# EasyEDA Pro project 电机驱动DRV8701_V2.0（无限流）.epro

# Schematic DRV8701_V2.0（无限流）
Board Name: DRV8701_V2.0（无限流）; Create Date: 2025-05-28; Page Name: P1; Project Name: 电机驱动; Schematic Name: DRV8701_V2.0（无限流）; Update Date: 2025-05-29; Company: 嘉立创EDA; Page Size: A4; Version: V1.0
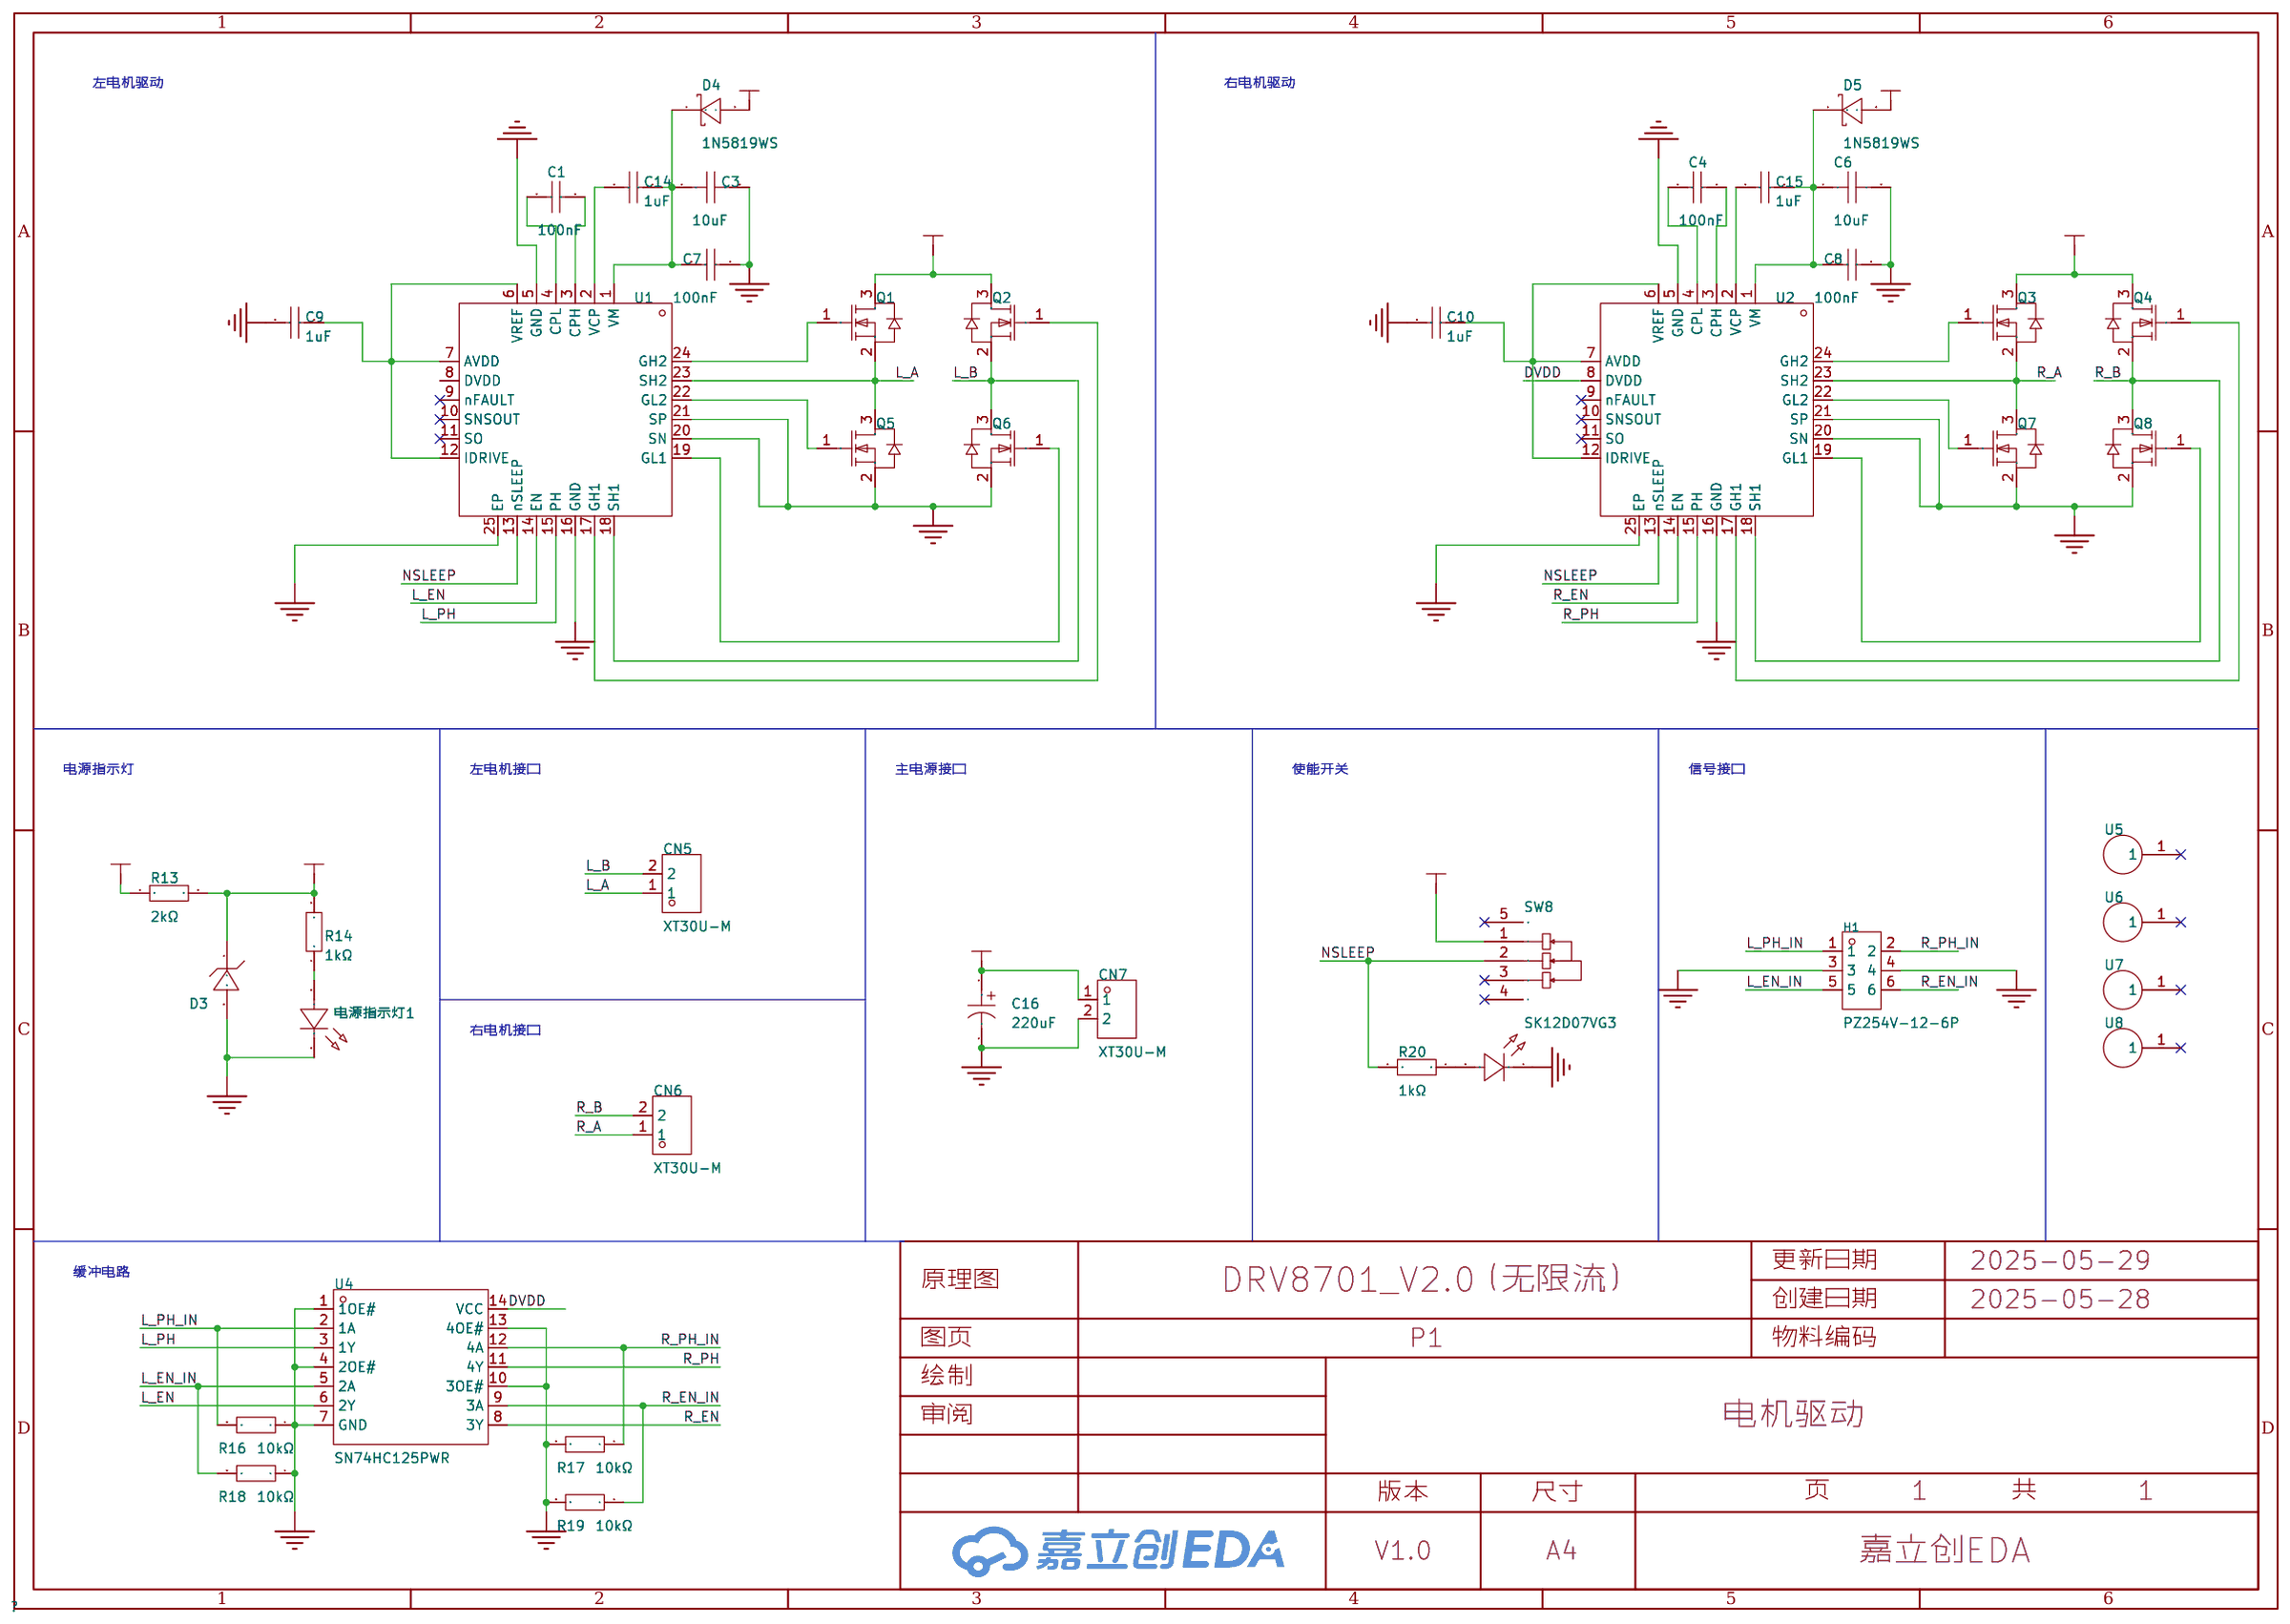
[diagram p0: schematic sheet]

## Parts
C1  100nF  [C0603]
C3  10uF  [C0603]
C4  100nF  [C0603]
C6  10uF  [C0603]
C7  100nF  [C0603]
C8  100nF  [C0603]
C9  1uF  [C0603]
C10  1uF  [C0603]
C14  1uF  [C0603]
C15  1uF  [C0603]
C16  220uF  [CAP-TH_BD6.3-P2.50-D0.5-FD]
CN5  XT30U-M  [CONN-TH_XT30U-M]
CN6  XT30U-M  [CONN-TH_XT30U-M]
CN7  XT30U-M  [CONN-TH_XT30U-M]
D3  BZT52C3V3-7-F  [SOD-123_L2.7-W1.6-LS3.7-RD]
D4  1N5819WS  [SOD-323_L1.8-W1.3-LS2.5-RD]
D5  1N5819WS  [SOD-323_L1.8-W1.3-LS2.5-RD]
H1  PZ254V-12-6P  [HDR-TH_6P-P2.54-V-M-R2-C3-S2.54]
Q1  2N7002  [DSOP-8_L5.0-W5.0-P1.27-LS6.0-BL-EP（rebuild）]
Q2  2N7002  [DSOP-8_L5.0-W5.0-P1.27-LS6.0-BL-EP（rebuild）]
Q3  2N7002  [DSOP-8_L5.0-W5.0-P1.27-LS6.0-BL-EP（rebuild）]
Q4  2N7002  [DSOP-8_L5.0-W5.0-P1.27-LS6.0-BL-EP（rebuild）]
Q5  2N7002  [DSOP-8_L5.0-W5.0-P1.27-LS6.0-BL-EP（rebuild）]
Q6  2N7002  [DSOP-8_L5.0-W5.0-P1.27-LS6.0-BL-EP（rebuild）]
Q7  2N7002  [DSOP-8_L5.0-W5.0-P1.27-LS6.0-BL-EP（rebuild）]
Q8  2N7002  [DSOP-8_L5.0-W5.0-P1.27-LS6.0-BL-EP（rebuild）]
R13  2kΩ  [R0603]
R14  1kΩ  [R0603]
R16  10kΩ  [R0603]
R17  10kΩ  [R0603]
R18  10kΩ  [R0603]
R19  10kΩ  [R0603]
R20  1kΩ  [R0603]
SW8  SK12D07VG3  [SW-TH_SK12D07VG3]
U1  DRV8701ERGET  [VQFN-24_L4.0-W4.0-P0.50-BL-EP2.5]
U2  DRV8701ERGET  [VQFN-24_L4.0-W4.0-P0.50-BL-EP2.5]
U4  SN74HC125PWR  [TSSOP-14_L5.0-W4.4-P0.65-LS6.5-BL]
U5  -  [M3螺丝孔]  (no BOM)
U6  -  [M3螺丝孔]  (no BOM)
U7  -  [M3螺丝孔]  (no BOM)
U8  -  [M3螺丝孔]  (no BOM)
电源指示灯1  XL-1608SURC-06  [LED0603-RD_RED]
电源指示灯2  XL-1608SURC-06  [LED0603-RD_RED]

## Library data of the parts
C1 C4 C7 C8 = CL10B104KO8NNNC: 容值:100nF;精度:±10%;额定电压:16V;材质(温度系数):X7R;; LCSC Part Name: 100nF ±10% 16V; Supplier Part: C66501; Manufacturer: SAMSUNG(三星); Supplier Footprint: 0603; JLCPCB Part Class: 扩展库; Datasheet: https://atta.szlcsc.com/upload/public/pdf/source/20160218/1457707763339.pdf; Supplier: LCSC; Tolerance: ±10%; Voltage Rated: 16V; Temperature Coefficient: X7R
C3 C6 = CL10A106MA8NRNC: 容值:10uF;精度:±20%;额定电压:25V;材质(温度系数):X5R;; LCSC Part Name: 10uF ±20% 25V; Supplier Part: C96446; Manufacturer: SAMSUNG(三星); Supplier Footprint: 0603; Datasheet: https://atta.szlcsc.com/upload/public/pdf/source/20160218/1457707763339.pdf; Supplier: LCSC; Tolerance: ±20%; Voltage Rated: 25V; Temperature Coefficient: X5R
C9 C10 C14 C15 = CL10B105KA8NNNC: 容值:1uF;精度:±10%;额定电压:25V;材质(温度系数):X7R;; LCSC Part Name: 1uF ±10% 25V; Supplier Part: C29936; Manufacturer: SAMSUNG(三星); Supplier Footprint: 0603; Datasheet: https://atta.szlcsc.com/upload/public/pdf/source/20160218/1457707763339.pdf; Supplier: LCSC; Tolerance: ±10%; Voltage Rated: 25V; Temperature Coefficient: X7R
C16 = 03EC0593: 容值:220uF;精度:±20%;额定电压:25V;纹波电流:400mA@100kHz;等效串联电阻:180mΩ@100kHz;; LCSC Part Name: 220uF ±20% 25V; Supplier Part: C2831777; Manufacturer: KNSCHA(科尼盛); Supplier Footprint: 插件,D6.3xL11.5mm; JLCPCB Part Class: 扩展库; Datasheet: https://atta.szlcsc.com/upload/public/pdf/source/20210511/C2831777_389FCE55455AE5EB982141C0CC76B0F0.pdf; Supplier: LCSC; Tolerance: ±20%; Rated Voltage: 25V; Ripple Current: 400mA@100kHz; Equivalent Series Resistance(ESR): 180mΩ@100kHz; Lead Spacing: 2.5mm; φD: 6.3mm; L: 11.5mm; Lifetime @ Temp: 7000hrs@105℃; Operating Temperature: -55℃~+105℃
CN5-CN7 = XT30U-M: 类别:-;类型1:-;; LCSC Part Name: AMASS(艾迈斯)轻量版锂电池插头公头 XT30U-M; Supplier Part: C99101; Manufacturer: AMASS(艾迈斯); JLCPCB Part Class: 扩展库; Datasheet: https://atta.szlcsc.com/upload/public/pdf/source/20170606/1496716542582.pdf; Supplier: LCSC; Brand: 艾迈斯; Type: 插头; Colour: 黄色; InterfaceType: 公头
D3 = BZT52C3V3-7-F: 二极管配置:独立式;稳压值(标称值):3.3V;稳压值(范围):3.1V~3.5V;功率:500mW;精度:±6%;; Supplier Part: C151564; Manufacturer: DIODES(美台); Supplier Footprint: SOD-123; Datasheet: https://atta.szlcsc.com/upload/public/pdf/source/20190711/C397931_3C6B91801DE45802E2D186F3C264AC27.pdf; Supplier: LCSC; Diode Configuration: 独立式; Zener Voltage (Nom): 3.3V; Reverse Leakage Current (Ir): 5uA@1V; Zener Voltage (Range): 3.1V~3.5V; Power Dissipation: 500mW; Zener Impedance (Zzt): 95Ω; Tolerance: ±6%
D4 D5 = 1N5819WS_C191023: 正向压降(Vf):600mV@1A;直流反向耐压(Vr):40V;整流电流:1A;; LCSC Part Name: 电压:40V 电流:1A; Supplier Part: C191023; Manufacturer: Hottech(合科泰); Supplier Footprint: SOD-323; JLCPCB Part Class: 基础库; Datasheet: https://atta.szlcsc.com/upload/public/pdf/source/20220428/3CB86FD8D28D653594B4E35F9D5AEFD9.pdf; Supplier: LCSC; Forward Voltage (Vf@If): 600mV@1A; Reverse Voltage (Vr): 40V; Rectified Current: 1A
H1 = PZ254V-12-6P: 排数:双排;总PIN位数:6P;间距:2.54mm;插针结构:2x3P;行距:2.54mm;安装类型:直插;圆针/方针:方针;额定电流:-;额定电压:-;配合针长度:6mm;塑高:2.5mm;端接针长度:3mm;触头材质:黄铜;触头镀层:-;工作温度范围:-40℃~+105℃;颜色:黑色;; LCSC Part Name: 2.54mm 2x3P 直插 方针; Supplier Part: C492420; Manufacturer: XFCN(兴飞); Supplier Footprint: 插件,P=2.54mm; JLCPCB Part Class: Extended Part; Datasheet: https://atta.szlcsc.com/upload/public/pdf/source/20200309/C492420_BAECB307B001054C09D200388220EAE6.pdf; Supplier: LCSC; Number of Rows: 双排; Number of Pins: 6P; Pitch: 2.54mm; Pin Structure: 2x3P; Row Spacing: 2.54mm; Mounting Type: 直插; Circluar Pins/Square Pins: 方针; Length of Mating Pin: 6mm; Insulation Height: 2.5mm; Length of End Connection Pin: 3mm; Contact Material: 黄铜; Operating Temperature Range: -40℃~+105℃; Color: 黑色
Q1-Q8 = TPH1R403NL(rebuild): LCSC Part Name: 1个N沟道 耐压:60V 电流:115mA; Supplier Part: C8545; Manufacturer: CJ(江苏长电/长晶); Supplier Footprint: SOT-23; Datasheet: https://atta.szlcsc.com/upload/public/pdf/source/20171228/C164913_15144413269051213916.pdf; Supplier: LCSC; Type: 1个N沟道; Drain Source Voltage (Vdss): 60V; Continuous Drain Current (Id): 115mA; Drain Source On Resistance (RDS(on)@Vgs,Id): 5Ω@10V; Power Dissipation (Pd): 225mW; Gate Threshold Voltage (Vgs(th)@Id): 2.5V@250uA; Input Capacitance (Ciss@Vds): 50pF; Reverse Transfer Capacitance (Crss@Vds): 5pF; Operating Temperature: -55℃~+150℃
R13 = 0603WAF2201T5E: 电阻类型:厚膜电阻;阻值:2.2kΩ;精度:±1%;功率:100mW;最大工作电压:75V;温度系数:±100ppm/℃;; LCSC Part Name: 2.2kΩ ±1% 100mW 厚膜电阻; Supplier Part: C4190; Manufacturer: UNI-ROYAL(厚声); Supplier Footprint: 0603; JLCPCB Part Class: 基础库; Datasheet: https://atta.szlcsc.com/upload/public/pdf/source/20200306/C422600_1E6D84923E4A46A82E41ADD87F860B5C.pdf; Supplier: LCSC; Type: 厚膜电阻; Tolerance: ±1%; Power(Watts): 100mW; Overload Voltage (Max): 75V; Temperature Coefficient: ±100ppm/℃; Operating Temperature Range: -55℃~+155℃
R14 R20 = 0603WAF1001T5E: 电阻类型:厚膜电阻;阻值:1kΩ;精度:±1%;功率:100mW;最大工作电压:75V;温度系数:±100ppm/℃;; LCSC Part Name: 1kΩ ±1% 100mW 厚膜电阻; Supplier Part: C21190; Manufacturer: UNI-ROYAL(厚声); Supplier Footprint: 0603; JLCPCB Part Class: 基础库; Datasheet: https://atta.szlcsc.com/upload/public/pdf/source/20200306/C422600_1E6D84923E4A46A82E41ADD87F860B5C.pdf; Supplier: LCSC; Type: 厚膜电阻; Tolerance: ±1%; Power(Watts): 100mW; Overload Voltage (Max): 75V; Temperature Coefficient: ±100ppm/℃; Operating Temperature Range: -55℃~+155℃
R16-R19 = 0603WAF1002T5E: 电阻类型:厚膜电阻;阻值:10kΩ;精度:±1%;功率:100mW;最大工作电压:75V;温度系数:±100ppm/℃;; LCSC Part Name: 厚膜电阻 10kΩ ±1% 100mW; Supplier Part: C25804; Manufacturer: UNI-ROYAL(厚声); Supplier Footprint: 0603; JLCPCB Part Class: 基础库; Datasheet: https://atta.szlcsc.com/upload/public/pdf/source/20200306/C422600_1E6D84923E4A46A82E41ADD87F860B5C.pdf; Supplier: LCSC; Type: 厚膜电阻; Tolerance: ±1%; Power(Watts): 100mW; Overload Voltage (Max): 75V; Temperature Coefficient: ±100ppm/℃; Operating Temperature Range: -55℃~+155℃
SW8 = SK12D07VG3: 电路结构:单刀双掷;安装方式:侧插;开关颜色:-;额定电流(DC):500mA;额定电压(DC):50V;额定电流(AC):-;额定电压(AC):-;机械寿命:5千次;; LCSC Part Name: 两档位卧式拨动开关,柄长3MM; Supplier Part: C431547; Manufacturer: SHOU HAN(首韩); Supplier Footprint: 插件; JLCPCB Part Class: 扩展库; Datasheet: https://atta.szlcsc.com/upload/public/pdf/source/20190925/C431547_01B93C6F3FA5C09E15F8CCBF4E6DB91A.pdf; Supplier: LCSC; Circuit: 单刀双掷; Pin Style: PC引脚; Switch Length: 8.7mm; Switch Width: 4.4mm; Switch Height: 4.7mm; Mounting Style: 侧插; Current Rating (DC): 500mA; Voltage Rating (DC): 50V; Mechanical Life: 5千次; Operating Temperature: -10℃~+50℃
U1 U2 = DRV8701ERGET: DRV8701 47V H 桥智能栅极驱动器; LCSC Part Name: 有刷直流电机驱动芯片 5.5V; Supplier Part: C132049; Manufacturer: TI(德州仪器); Supplier Footprint: VQFN-24(4x4); Datasheet: https://www.ti.com/cn/lit/gpn/drv8701; Supplier: LCSC
U4 = SN74HC125PWR: 输入类型:-;电源电压:2V~6V;元件数:4;每个元件位数:1;灌电流(IOL):7.8mA;拉电流(IOH):7.8mA;; Supplier Part: C132994; Manufacturer: TI(德州仪器); Supplier Footprint: TSSOP-14; JLCPCB Part Class: 扩展库; Datasheet: https://www.ti.com/cn/lit/gpn/sn74hc125; Supplier: LCSC; output type: 三态; Supply Voltage: 2V~6V; Number of Elements: 4; Number of Bits per Element: 1; Sink Current: 7.8mA; Source Current: 7.8mA; Logic Family: 74HC; Operating Temperature: -40℃~+85℃
U5-U8 = M3螺丝孔
电源指示灯1 电源指示灯2 = XL-1608SURC-06: 发光颜色:红色;功率:55mW;正向电流:25mA;主波长:617nm~621nm;透镜颜色:无色透明透镜;色温:-;发光角度:120°;载带方式:正贴;工作温度:-30℃~+85℃;; Supplier Part: C965799; Manufacturer: XINGLIGHT(成兴光); Supplier Footprint: 0603; Datasheet: https://atta.szlcsc.com/upload/public/pdf/source/20221102/D860AFDD1CDB02C5A8064103A32707E2.pdf; Supplier: LCSC; Emitted Color: 红色; Power Dissipation: 55mW; Forward Current: 25mA; Dominant Wavelength: 617nm~621nm; Peak Wavelength: 623nm; Lens Color: 无色透明透镜; Viewing Angle: 120°; Mounting Sytle: 正贴; Operating Temperature: -30℃~+85℃

## Nets
3.3V: D3.1(K) R13.2 R14.2 SW8.1
DVDD: U2.8(DVDD) U4.14(VCC)
GND: C3.2 C6.2 C7.1 C8.1 C9.2 C10.2 C16.2 CN7.2 D3.2(A) H1.3 H1.4 Q5.2(S) Q6.2(S) Q7.2(S) Q8.2(S) R16.1 R17.2 R18.1 R19.2 U1.5(GND) U1.16(GND) U1.20(SN) U1.21(SP) U1.25(EP) U2.5(GND) U2.16(GND) U2.20(SN) U2.21(SP) U2.25(EP) U4.1(1OE#) U4.4(2OE#) U4.7(GND) U4.10(3OE#) U4.13(4OE#) 电源指示灯1.1(K) 电源指示灯2.1(K)
L_A: CN5.1 Q1.2(S) Q5.3(D) U1.23(SH2)
L_B: CN5.2 Q2.2(S) Q6.3(D) U1.18(SH1)
L_EN: U1.14(EN) U4.6(2Y)
L_EN_IN: H1.5 R18.2 U4.5(2A)
L_PH: U1.15(PH) U4.3(1Y)
L_PH_IN: H1.1 R16.2 U4.2(1A)
NSLEEP: R20.2 SW8.2 U1.13(nSLEEP) U2.13(nSLEEP)
R_A: CN6.1 Q3.2(S) Q7.3(D) U2.23(SH2)
R_B: CN6.2 Q4.2(S) Q8.3(D) U2.18(SH1)
R_EN: U2.14(EN) U4.8(3Y)
R_EN_IN: H1.6 R19.1 U4.9(3A)
R_PH: U2.15(PH) U4.11(4Y)
R_PH_IN: H1.2 R17.1 U4.12(4A)
VM: C16.1 CN7.1 D4.2(A) D5.2(A) Q1.3(D) Q2.3(D) Q3.3(D) Q4.3(D) R13.1
$1N2924: C14.2 U1.2(VCP)
$1N2925: C1.1 U1.3(CPH)
$1N2926: C1.2 U1.4(CPL)
$1N2930: Q1.1(G) U1.24(GH2)
$1N2931: Q5.1(G) U1.22(GL2)
$1N2933: Q6.1(G) U1.19(GL1)
$1N2936: Q2.1(G) U1.17(GH1)
$1N2950: C9.1 U1.6(VREF) U1.7(AVDD) U1.12(IDRIVE)
$1N2981: C3.1 C7.2 C14.1 D4.1(K) U1.1(VM)
$1N2986: C15.2 U2.2(VCP)
$1N2987: C4.1 U2.3(CPH)
$1N2988: C4.2 U2.4(CPL)
$1N2992: Q3.1(G) U2.24(GH2)
$1N2993: Q7.1(G) U2.22(GL2)
$1N2995: Q8.1(G) U2.19(GL1)
$1N2998: Q4.1(G) U2.17(GH1)
$1N3012: C10.1 U2.6(VREF) U2.7(AVDD) U2.12(IDRIVE)
$1N3023: C6.1 C8.2 C15.1 D5.1(K) U2.1(VM)
$1N3029: R14.1 电源指示灯1.2(A)
$1N3716: R20.1 电源指示灯2.2(A)

Not connected (* = marked no-connect by the designer): SW8 3* 4* 5*; U1 8(DVDD) 9(nFAULT)* 10(SNSOUT)* 11(SO)*; U2 9(nFAULT)* 10(SNSOUT)* 11(SO)*; U5 1*; U6 1*; U7 1*; U8 1*

## Notes on the sheet
- 左电机驱动
- 右电机驱动
- 电源指示灯
- 左电机接口
- 主电源接口
- 使能开关
- 信号接口
- 右电机接口
- 缓冲电路

# Board DRV8701_V2.0（无限流）
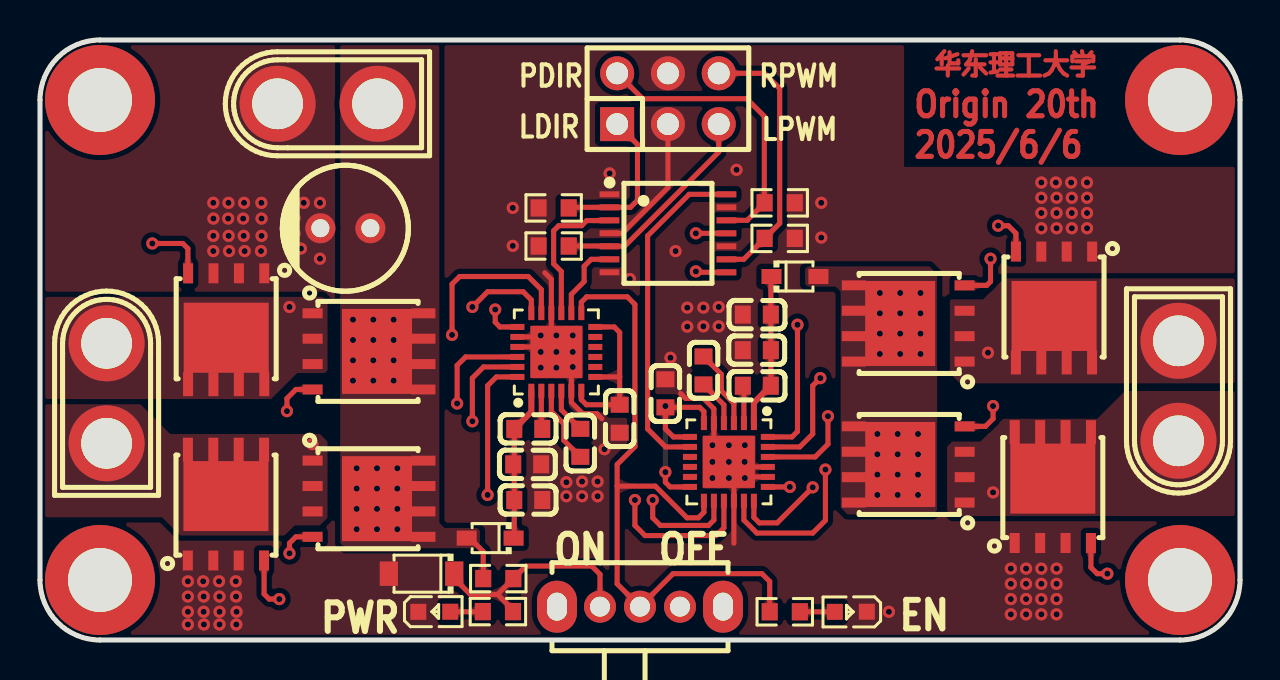
[diagram p1: board, top side]
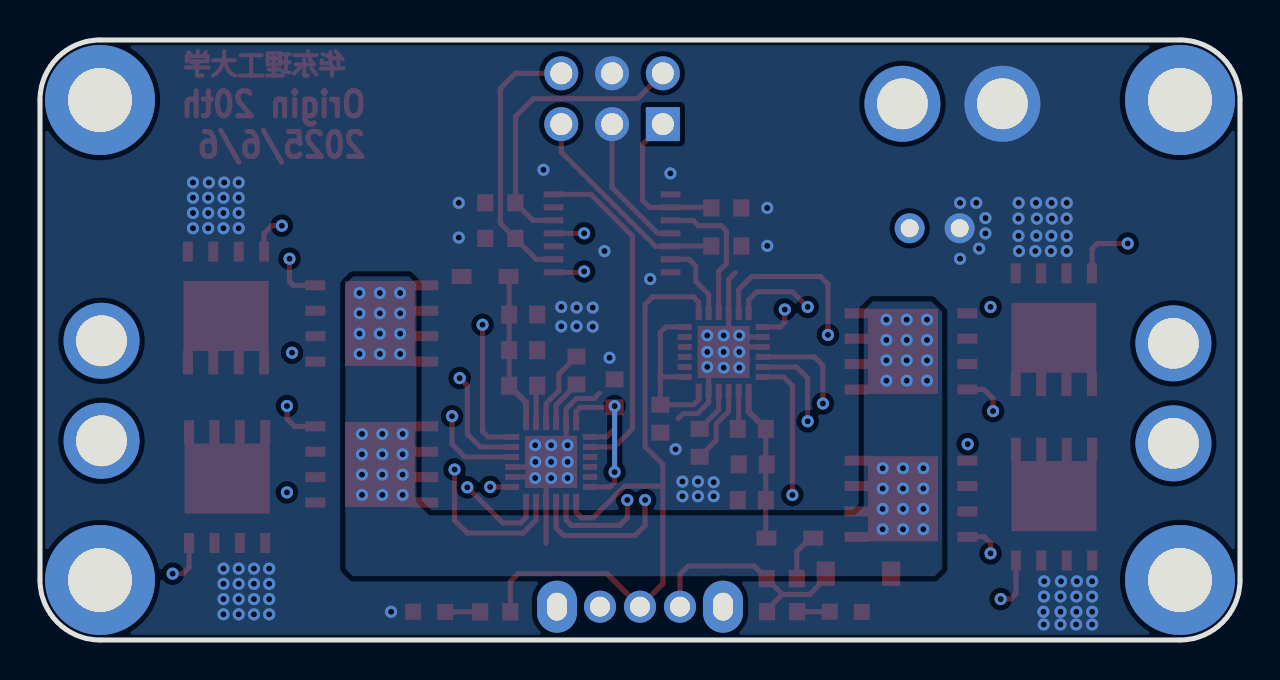
[diagram p2: board, bottom side, seen from below]

Outline 60 x 30 mm; copper layers: Top Layer, Inner1, Inner2, Bottom Layer. Coordinates in mm from the lower left corner of the outline.
Outline path: 0,27 0,3 arc(0.88,0.88) 3,0 57,0 arc(59.12,0.88) 60,3 60,27 arc(59.12,29.12) 57,30 3,30 arc(0.88,29.12) 0,27
Stack: Top Layer 0.035mm 外层铜厚1oz / Dielectric1 0.2104mm 7628 RC49% 8.6mil / Inner1 0.0152mm 内层铜厚 / Dielectric2 1.065mm 1.1mm H/HOZ Copper / Inner2 0.0152mm 内层铜厚 / Dielectric3 0.2104mm 7628 RC49% 8.6mil / Bottom Layer 0.035mm 外层铜厚1oz

## Design rules (mm)
template: 4层
spacing copperThickness1oz (default): track to track 0.102, other pairs 0.152 to 0.3
spacing copperThickness2oz: track to track 0.203, other pairs 0.152 to 0.3
spacing copperThicknessInner0.5oz: track to track 0.089, other pairs 0.152 to 0.3
spacing 板框焊盘0间距: track to track 0.152, other pairs 0 to 0.3
track width copperThickness1oz (default): min 0.102, default 0.254, max 2.54
track width copperThickness2oz: min 0.203, default 0.254, max 2.54
track width copperThickness0.5oz: min 0.089, default 0.254, max 2.54
differential pair differentialPair (default): width min 0.127, default 0.254, max 2.54; gap min 0.152, default 0.152
via viaSize (default): diameter min 0.3, default 0.61, max 10; hole min 0.2, default 0.305, max 6.3
region e13 uses 板框焊盘0间距
region e14 uses 板框焊盘0间距
region e15 uses 板框焊盘0间距
region e59 uses 板框焊盘0间距

## Placement (name value [footprint] x y rotation side)
C1  100nF  [C0603]  27.02 9.86 90 top
C3  10uF  [C0603]  24.41 7 0 top
C4  100nF  [C0603]  33.18 13.48 270 top
C6  10uF  [C0603]  35.84 16.27 180 top
C7  100nF  [C0603]  24.36 8.78 180 top
C8  100nF  [C0603]  35.84 14.49 0 top
C9  1uF  [C0603]  28.98 11.06 270 top
C10  1uF  [C0603]  31.27 12.33 90 top
C14  1uF  [C0603]  24.41 10.56 0 top
C15  1uF  [C0603]  35.84 12.71 180 top
C16  220uF  [CAP-TH_BD6.3-P2.50-D0.5-FD]  15.27 20.59 180 top
CN5  XT30U-M  [CONN-TH_XT30U-M]  3.33 12.33 90 top
CN6  XT30U-M  [CONN-TH_XT30U-M]  56.92 12.46 270 top
CN7  XT30U-M  [CONN-TH_XT30U-M]  14.38 26.81 180 top
D3  BZT52C3V3-7-F  [SOD-123_L2.7-W1.6-LS3.7-RD]  19.08 3.32 180 top
D4  1N5819WS  [SOD-323_L1.8-W1.3-LS2.5-RD]  22.51 5.09 180 top
D5  1N5819WS  [SOD-323_L1.8-W1.3-LS2.5-RD]  37.75 18.17 0 top
H1  PZ254V-12-6P  [HDR-TH_6P-P2.54-V-M-R2-C3-S2.54]  31.4 27.06 0 top
Q1  2N7002  [DSOP-8_L5.0-W5.0-P1.27-LS6.0-BL-EP（rebuild）]  16.4 7.06 270 top
Q2  2N7002  [DSOP-8_L5.0-W5.0-P1.27-LS6.0-BL-EP（rebuild）]  16.4 14.43 270 top
Q3  2N7002  [DSOP-8_L5.0-W5.0-P1.27-LS6.0-BL-EP（rebuild）]  43.46 15.83 90 top
Q4  2N7002  [DSOP-8_L5.0-W5.0-P1.27-LS6.0-BL-EP（rebuild）]  43.46 8.78 90 top
Q5  2N7002  [DSOP-8_L5.0-W5.0-P1.27-LS6.0-BL-EP（rebuild）]  9.3 6.75 0 top
Q6  2N7002  [DSOP-8_L5.0-W5.0-P1.27-LS6.0-BL-EP（rebuild）]  9.31 15.56 180 top
Q7  2N7002  [DSOP-8_L5.0-W5.0-P1.27-LS6.0-BL-EP（rebuild）]  50.7 16.65 180 top
Q8  2N7002  [DSOP-8_L5.0-W5.0-P1.27-LS6.0-BL-EP（rebuild）]  50.64 7.62 0 top
R13  2kΩ  [R0603]  22.91 3.07 0 top
R14  1kΩ  [R0603]  22.9 1.42 0 top
R16  10kΩ  [R0603]  25.68 21.6 0 top
R17  10kΩ  [R0603]  36.99 21.86 0 top
R18  10kΩ  [R0603]  25.68 19.7 0 top
R19  10kΩ  [R0603]  36.99 20.08 0 top
R20  1kΩ  [R0603]  37.24 1.41 180 top
SW8  SK12D07VG3  [SW-TH_SK12D07VG3]  30 1.67 0 top
U1  DRV8701ERGET  [VQFN-24_L4.0-W4.0-P0.50-BL-EP2.5]  25.82 14.4 0 top
U2  DRV8701ERGET  [VQFN-24_L4.0-W4.0-P0.50-BL-EP2.5]  34.44 8.9 180 top
U4  SN74HC125PWR  [TSSOP-14_L5.0-W4.4-P0.65-LS6.5-BL]  31.4 20.33 270 top
U5  -  [M3螺丝孔]  57 27 0 top
U6  -  [M3螺丝孔]  57 3 0 top
U7  -  [M3螺丝孔]  3 3 0 top
U8  -  [M3螺丝孔]  3 27 0 top
电源指示灯1  XL-1608SURC-06  [LED0603-RD_RED]  19.71 1.41 0 top
电源指示灯2  XL-1608SURC-06  [LED0603-RD_RED]  40.54 1.41 180 top

## Footprints (pads in the part's own frame, mm; a bottom-side part is the same pattern mirrored in y, then rotated)
C0603
  rect 0.8x0.9 smd: 1(-0.7,0) 2(0.7,0)
CAP-TH_BD6.3-P2.50-D0.5-FD
  round 1.5 hole 0.9: 1(-1.25,0) 2(1.25,0)
CONN-TH_XT30U-M
  round 3.8 hole 2.54: 1(-2.5,0) 2(2.5,0)
DSOP-8_L5.0-W5.0-P1.27-LS6.0-BL-EP（rebuild）
  rect 0.5x1 smd: 1(1.905,-2.77) 2(-1.905,-2.77) 2(-0.635,-2.77) 2(0.634,-2.77)
  rect 0.5x1.2 smd: 3(-1.905,2.77) 3(-0.634,2.77) 3(0.635,2.77) 3(1.905,2.77)
  custom 4.25x3.5 smd: 3(0,0.45)
HDR-TH_6P-P2.54-V-M-R2-C3-S2.54
  rect 1.7x1.7 hole 1.1: 1(-2.54,-1.27)
  round 1.7 hole 1.1: 2(-2.54,1.27) 3(0,-1.27) 4(0,1.27) 5(2.54,-1.27) 6(2.54,1.27)
LED0603-RD_RED
  rect 0.8x0.8 smd: 1(-0.799,-0.004) 2(0.799,0.004)
M3螺丝孔
  round 5.5 hole 3.2: 1(0,0)
R0603
  rect 0.806x0.864 smd: 1(-0.753,0) 2(0.753,0)
SOD-123_L2.7-W1.6-LS3.7-RD
  rect 0.91x1.22 smd: 1(-1.635,0) 2(1.635,0)
SOD-323_L1.8-W1.3-LS2.5-RD
  rect 1x0.75 smd: 1(-1.173,0) 2(1.173,0)
SW-TH_SK12D07VG3
  oval 1.6x1.6 hole 1: 1(-2,0) 2(0,0) 3(2,0)
  oval 2x2.6 hole 1x1.4: 4(4.15,0) 5(-4.15,0)
TSSOP-14_L5.0-W4.4-P0.65-LS6.5-BL
  rect 0.305x0.991 smd: 1(-1.95,-2.925) 2(-1.3,-2.925) 3(-0.65,-2.925) 4(0,-2.925) 5(0.65,-2.925) 6(1.3,-2.925) 7(1.95,-2.925) 8(1.95,2.925) 9(1.3,2.925) 10(0.65,2.925) 11(0,2.925) 12(-0.65,2.925) 13(-1.3,2.925) 14(-1.95,2.925)
VQFN-24_L4.0-W4.0-P0.50-BL-EP2.5
  rect 0.3x0.7 smd: 1(-1.25,-1.942) 2(-0.75,-1.942) 3(-0.25,-1.942) 4(0.25,-1.942) 5(0.75,-1.942) 6(1.25,-1.942) 13(1.25,1.942) 14(0.75,1.942) 15(0.25,1.942) 16(-0.25,1.942) 17(-0.75,1.942) 18(-1.25,1.942)
  rect 0.7x0.3 smd: 7(1.948,-1.25) 8(1.948,-0.75) 9(1.948,-0.25) 10(1.948,0.25) 11(1.948,0.75) 12(1.948,1.25) 19(-1.948,1.25) 20(-1.948,0.75) 21(-1.948,0.25) 22(-1.948,-0.25) 23(-1.948,-0.75) 24(-1.948,-1.25)
  rect 2.6x2.6 smd: 25(0.001,-0.001)

## Nets
As in the schematic.

Pads without a net: SW8 3 4 5; U1 8 9 10 11; U2 9 10 11; U5 1; U6 1; U7 1; U8 1

## Via types
v1: diameter 0.61, hole 0.305, Top Layer to Bottom Layer, 189 vias

## Routing (per net, layer and track width the routed paths; a pad name or vN(x,y) marks a point on that pad's centre or on a via; arc(x,y) is an arc through that point)
3.3V: length 11.4
  Top Layer w0.254: 20.84,3.32 20.84,2.96 21.52,2.28 22.88,2.28 ; 22.88,2.28 R13.2 24.29,3.7 27.59,3.7 28,3.28 SW8.1 ; 22.88,2.28 23.65,1.51 R14.2
DVDD: length 16.9
  Top Layer w0.254: U2.8 31.28,9.65 30.38,10.56 30.38,20.21 32.46,22.28 U4.14
GND: length 29.4
  Top Layer w0.254: v1(35.23,8.91) 35.48,8.65 U2.21 ; 25.24,18.37 25.57,18.04 U1.16 25.57,14.65 ; H1.3 31.4,22.62 29.11,20.33 U4.4 ; 25.57,14.65 v1(25.82,14.4) 25.89,14.4 v1(26.64,13.65) 26.57,13.58 U1.5 26.57,11.88 27.13,11.32 27.84,11.32 28.09,11.06 ; 25.57,14.65 23.87,14.65 ; v1(34.44,8.91) 34.69,8.65 U2.16 34.69,4.84 ; U2.20 35.3,8.15 v1(35.24,8.1) ; 23.87,15.15 24.96,15.15 v1(25.04,15.23) ; v1(33.62,9.74) 33.69,9.81 U2.5 33.69,11.56 33.18,12.08 32.29,12.08 32.03,12.33
  vias: v1(7.39,2.94) v1(7.39,2.17) v1(7.39,1.41) v1(7.39,0.78) v1(8.16,2.94) v1(8.18,2.17) v1(8.18,1.41) v1(8.19,0.78) v1(8.66,21.86) v1(8.67,21.07) v1(8.66,20.21) v1(8.66,19.44) v1(8.95,2.94) v1(8.97,2.17) v1(8.97,1.41) v1(8.97,0.78) v1(9.42,21.86) v1(9.41,21.07) v1(9.43,20.21) v1(9.45,19.44) v1(9.79,2.94) v1(9.8,2.17) v1(9.83,1.41) v1(9.81,0.78) v1(10.2,21.86) v1(10.16,21.07) v1(10.19,20.21) v1(10.23,19.44) v1(11.07,21.86) v1(11.08,21.07) v1(11.08,20.21) v1(11.05,19.44) v1(12.73,21.1) v1(12.73,20.33) v1(13.05,19.57) v1(13.19,21.86) v1(14,21.86) v1(14,19.06) v1(23.64,21.6) v1(23.64,19.71) v1(25.04,14.4) v1(25.04,13.61) v1(25.82,15.23) v1(25.82,13.61) v1(26.32,7.89) v1(26.32,7.19) v1(26.64,15.23) v1(26.64,14.4) v1(27.1,7.92) v1(27.1,7.19) v1(27.88,7.92) v1(27.88,7.19) v1(28.22,9.54) v1(28.48,23.33) v1(29.49,18.05) v1(31.52,14.11) v1(31.78,19.44) v1(32.36,16.62) v1(32.36,15.67) v1(33.17,16.62) v1(33.17,15.68) v1(33.62,8.91) v1(33.62,8.1) v1(33.94,16.65) v1(33.94,15.68) v1(34.44,9.74) v1(34.44,8.1) v1(34.83,23.51) v1(35.24,9.74) v1(39.06,21.86) v1(39.06,20.12) v1(42.45,1.41) v1(48.54,3.57) v1(48.54,2.81) v1(48.54,2.05) v1(48.54,1.28) v1(49.3,3.57) v1(49.3,2.81) v1(49.3,2.05) v1(49.3,1.28) v1(50.07,22.87) v1(50.07,22.11) v1(50.07,21.35) v1(50.07,20.59) v1(50.07,3.57) v1(50.07,2.81) v1(50.07,2.05) v1(50.07,1.28) v1(50.79,22.87) v1(50.83,22.11) v1(50.83,21.35) v1(50.83,20.59) v1(50.83,3.57) v1(50.83,2.81) v1(50.83,2.05) v1(50.83,1.28) v1(51.56,22.87) v1(51.59,22.11) v1(51.59,21.35) v1(51.59,20.59) v1(52.35,22.87) v1(52.35,22.11) v1(52.35,21.35) v1(52.35,20.59)
L_A: length 13.1
  Top Layer w0.254: v1(21.62,10.94) 21.62,13.09 22.18,13.65 U1.23
  Inner1 w0.254: v1(13.62,9.79) 20.47,9.79 v1(21.62,10.94)
L_B: length 13.2
  Top Layer w0.254: U1.18 24.57,17 24.16,17.41 22.38,17.41 v1(21.62,16.65)
  Inner1 w0.254: v1(21.62,16.65) v1(12.47,16.65)
L_EN: length 4
  Top Layer w0.254: U1.14 26.57,17.28 27.21,17.92 27.21,18.68 27.56,19.03 U4.6
L_EN_IN: length 10.9
  Top Layer w0.254: R18.2 28.46,19.7 U4.5 29.22,19.68 33.94,24.4 H1.5
L_PH: length 7.3
  Top Layer w0.254: U1.15 26.07,18.42 25.68,18.81 25.68,20.46 25.94,20.72 27.08,20.72 27.33,20.97 28.46,20.97 U4.3
L_PH_IN: length 7.8
  Top Layer w0.254: R16.2 26.47,21.63 U4.2 29.52,21.63 29.87,21.98 29.87,24.78 H1.1
NSLEEP: length 34
  Top Layer w0.254: R20.2 36.49,2.93 36.1,3.32 31.65,3.32 SW8.2 28.86,2.81 28.86,7.69 ; U2.13 33.19,6.38 32.92,6.11 32.35,6.11 30.77,7.69 28.86,7.69 ; 28.86,7.69 28.86,8.78 29.75,9.67 29.75,16.78 29.37,17.16 27.33,17.16 27.07,16.89 U1.13
R_A: length 14.4
  Top Layer w0.254: v1(39.02,13.09) 38.64,12.71 38.64,10.3 37.99,9.65 U2.23
  Inner1 w0.254: v1(39.02,13.09) 39.65,13.73 41.74,13.73 41.75,13.72 44.27,13.72 44.28,13.73 46.76,13.73 v1(47.4,14.36)
R_B: length 14.5
  Top Layer w0.254: U2.18 35.69,6.13 35.97,5.86 36.86,5.86 v1(38.64,7.63)
  Inner1 w0.254: v1(38.64,7.63) 40.03,7.63 41.18,6.49 46.76,6.49 v1(47.65,7.38)
R_EN: length 19.9
  Top Layer w0.254: v1(32.79,18.43) 32.84,18.38 U4.8 ; v1(30.63,7) 30.63,6.11 31.02,5.73 33.43,5.73 33.69,6 U2.14
  Inner1 w0.254: v1(32.79,18.43) 31.27,18.43 30.63,17.79 v1(30.63,7)
R_EN_IN: length 13.5
  Top Layer w0.254: U4.9 35.19,19.03 R19.1 36.99,20.83 36.99,27.57 36.22,28.33 H1.6
R_PH: length 24.6
  Top Layer w0.254: U2.15 34.19,5.61 33.81,5.22 30.25,5.22 29.75,5.73 v1(29.75,7) ; v1(32.79,20.33) U4.11
  Inner1 w0.254: v1(32.79,20.33) 31.02,20.33 30.13,19.44 30.13,8.65 29.75,8.27 v1(29.75,7)
R_PH_IN: length 14.9
  Top Layer w0.254: U4.12 35.36,20.98 36.22,21.84 ; 36.22,21.84 36.22,26.18 35.33,27.06 30.13,27.06 H1.2 ; 36.22,21.84 R17.1
VM: length 2.5
  Top Layer w0.254: D4.2 21.49,5.09 22.16,4.42 R13.1
  vias: v1(15.65,16.02) v1(15.65,15) v1(15.65,13.98) v1(15.65,12.97) v1(15.83,8.59) v1(15.83,7.57) v1(15.83,6.56) v1(15.83,5.54) v1(16.66,16.02) v1(16.66,15) v1(16.66,13.98) v1(16.66,12.97) v1(16.85,8.59) v1(16.85,7.57) v1(16.85,6.56) v1(16.85,5.54) v1(17.68,16.02) v1(17.68,15) v1(17.68,13.98) v1(17.68,12.97) v1(17.87,8.59) v1(17.87,7.57) v1(17.87,6.56) v1(17.87,5.54) v1(41.87,10.3) v1(41.87,9.28) v1(41.87,8.27) v1(41.87,7.25) v1(41.99,17.35) v1(41.99,16.33) v1(41.99,15.32) v1(41.99,14.3) v1(42.88,10.3) v1(42.88,9.28) v1(42.88,8.27) v1(42.88,7.25) v1(43.01,17.35) v1(43.01,16.33) v1(43.01,15.32) v1(43.01,14.3) v1(43.9,10.3) v1(43.9,9.28) v1(43.9,8.27) v1(43.9,7.25) v1(44.03,17.35) v1(44.03,16.33) v1(44.03,15.32) v1(44.03,14.3)
$1N2924: length 1.9
  Top Layer w0.254: U1.2 25.07,10.6 C14.2
$1N2925: length 3.9
  Top Layer w0.254: C1.1 26.19,9.98 26.19,10.81 25.57,11.43 U1.3
$1N2926: length 2.3
  Top Layer w0.254: U1.4 26.07,11.51 C1.2
$1N2930: length 21.8
  Top Layer w0.254: Q1.1 12.79,5.16 12.47,4.84 v1(12.47,4.33) ; 23.87,13.15 22.82,13.15 22.38,12.71 v1(22.38,7.25)
  Inner1 w0.254: v1(12.47,4.33) 12.85,3.95 21.49,3.95 22.38,4.84 v1(22.38,7.25)
$1N2931: length 25.6
  Top Layer w0.254: 11.2,3.97 11.2,2.3 11.46,2.05 v1(11.97,2.05) ; 23.87,14.15 21.28,14.15 20.86,13.73 v1(20.86,11.83)
  Inner1 w0.254: v1(20.86,11.83) 19.51,10.48 12.65,10.48 11.76,9.59 11.76,4.15 12.35,3.57 12.35,2.43 v1(11.97,2.05)
$1N2933: length 25
  Top Layer w0.254: v1(22.76,16.52) 22.76,15.89 23,15.65 23.87,15.65 ; v1(5.62,19.83) 7.14,19.83 7.39,19.57 7.39,18.34 Q6.1
  Inner1 w0.254: v1(22.76,16.52) 21.75,17.54 5.87,17.54 5.23,18.17 5.23,19.44 v1(5.62,19.83)
$1N2936: length 22.5
  Top Layer w0.254: v1(12.35,11.44) 12.35,12.08 12.79,12.53 Q2.1 ; v1(20.6,15.25) 20.6,17.79 20.98,18.17 24.41,18.17 25.07,17.52 U1.17
  Inner1 w0.254: v1(20.6,15.25) 20.09,14.75 20.09,12.08 18.95,10.94 12.85,10.94 v1(12.35,11.44)
$1N2950: length 8.6
  Top Layer w0.254: 28.98,13.15 28.98,15.38 28.71,15.65 27.77,15.65 ; 28.98,13.15 C9.1 27.32,11.76 27.07,12.02 U1.6 ; 28.98,13.15 27.77,13.15
$1N2981: length 7.5
  Top Layer w0.254: C14.1 C3.1 23.71,5.38 23.68,5.35
  Top Layer w0.299: U1.1 24.57,11.41 C14.1
$1N2986: length 1.9
  Top Layer w0.254: U2.2 35.19,12.66 C15.2
$1N2987: length 4
  Top Layer w0.254: C4.1 34.06,13.29 34.06,12.46 34.69,11.83 U2.3
$1N2988: length 2.4
  Top Layer w0.254: C4.2 34.19,11.76 U2.4
$1N2992: length 22.6
  Top Layer w0.254: v1(37.87,15.76) 37.87,10.43 37.6,10.15 U2.24 ; Q3.1 47.34,17.73 47.53,17.92 v1(47.53,19.06)
  Inner1 w0.254: v1(37.87,15.76) 37.87,18.94 38.38,19.44 47.15,19.44 v1(47.53,19.06)
$1N2993: length 24.6
  Top Layer w0.254: v1(39.4,11.19) 39.4,9.79 38.76,9.15 U2.22 ; 48.8,19.42 48.8,20.33 48.41,20.72 v1(47.91,20.72)
  Inner1 w0.254: v1(47.91,20.72) 47.65,20.46 47.65,19.95 48.29,19.32 48.29,13.6 47.78,13.09 40.29,13.09 39.4,12.21 v1(39.4,11.19)
$1N2995: length 22.7
  Top Layer w0.254: U2.19 v1(37.49,7.65) ; v1(53.37,3.32) 52.86,3.32 52.55,3.63 Q8.1
  Inner1 w0.254: v1(53.37,3.32) 53.75,3.7 53.75,5.47 53.5,5.73 39.42,5.73 v1(37.49,7.65)
$1N2998: length 21.5
  Top Layer w0.254: v1(39.27,8.52) 39.27,5.98 38.64,5.35 35.84,5.35 35.19,6 U2.17 ; v1(47.65,11.7) 47.65,11.06 47.27,10.68 Q4.1
  Inner1 w0.254: v1(47.65,11.7) 47.15,12.21 41.18,12.21 40.29,11.32 40.29,9.54 v1(39.27,8.52)
$1N3012: length 10.3
  Top Layer w0.254: v1(31.27,11.7) C10.1 31.27,10.56 31.67,10.15 U2.7 ; 31.46,11.63 32.99,11.63 33.19,11.42 U2.6 ; v1(31.27,8.4) 31.27,7.89 31.5,7.65 U2.12 ; 31.46,11.7 31.27,11.89
  Bottom Layer w0.254: v1(31.27,8.4) v1(31.27,11.7)
$1N3023: length 7.7
  Top Layer w0.254: D5.1 36.54,18.14 C6.1 C8.2 C15.1
  Top Layer w0.299: U2.1 35.69,11.87 C15.1
$1N3029: length 1.6
  Top Layer w0.254: 电源指示灯1.2 22.14,1.41 R14.1
$1N3716: length 1.8
  Top Layer w0.254: R20.1 39.74,1.41 电源指示灯2.2

## Copper pours and planes (outline as drawn; the poured copper is in the pictures)
GND on Top Layer: 0.03,29.99 59.97,29.99 59.97,0.01 0.03,0.01
GND on Bottom Layer: -0.23,29.99 59.97,29.99 59.97,0.01 -0.23,0.01
GND on Inner1: 0.03,29.99 59.97,29.99 59.97,0.01 0.03,0.01
GND on Inner2: -0.1,29.99 59.97,29.99 59.97,0.01 -0.1,0.01
L_A on Top Layer: 14.38,6.11 14.38,9.92 14,10.3 6.5,10.3 4.85,11.95 0,11.95 0,6.13 6.1,6.13 7.01,5.22 12.22,5.22 12.73,5.73 14,5.73
L_B on Top Layer: 14.38,13.48 14.38,16.91 14.12,17.16 0,17.16 0,12.05 11.55,12.05 12.85,13.35 14.25,13.35
R_A on Top Layer: 45.49,17.03 47.15,17.03 48.2,18.08 60,18.08 60,12.84 46,12.84 45.49,13.34
R_B on Top Layer: 47.02,9.92 48.16,11.06 52.86,11.06 54.25,12.45 60,12.45 60,6.2 45.63,6.2 45.35,6.48 45.35,9.67 45.61,9.92
VM on Top Layer: 40.03,6.62 40.03,17.41 39.78,17.67 38.38,17.67 38.25,17.79 38.25,18.56 38.38,18.68 44.48,18.68 44.86,18.3 44.86,6.49 44.65,6.28 40.37,6.28
VM on Top Layer: 15.01,30 15.01,4.84 15.27,4.59 21.75,4.59 22,4.84 22,5.47 21.87,5.6 20.22,5.6 19.97,5.86 19.97,30
VM on Bottom Layer: 14.89,16.4 14.89,3.57 15.27,3.19 44.35,3.19 44.73,3.57 44.73,17.79 44.35,18.17 41.56,18.17 41.18,17.79 41.18,6.87 40.54,6.24 19.25,6.24 18.81,6.68 18.81,16.48 18.36,16.93 15.42,16.93

Small or netless copper shapes (teardrops, artwork), in the pictures only: 162 on Top Layer, 2 on Bottom Layer, 28 on Inner1

## Text on the board
Top Layer: Origin 20th | 2025/6/6 | 华东理工大学
Top Solder Mask Layer: Origin 20th | 2025/6/6 | 华东理工大学
Top Silkscreen Layer: PDIR | LDIR | RPWM | LPWM | PWR | ON | OFF | EN
